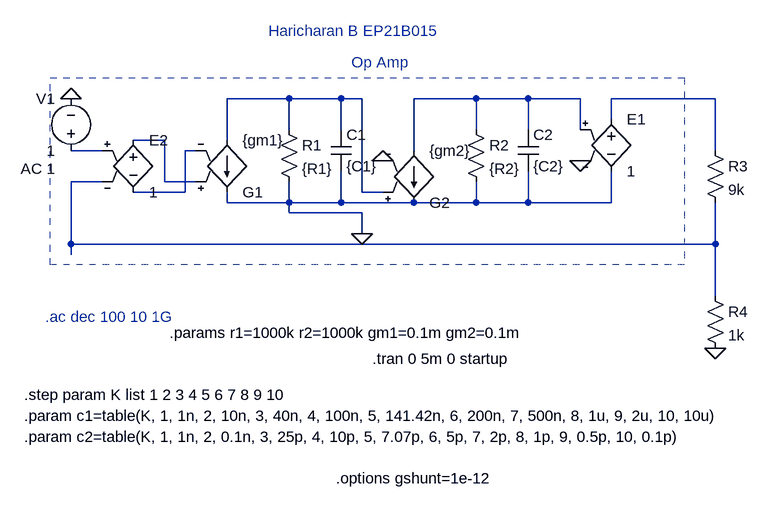
[diagram p0: schematic tut4 ii.asc]
tut4 ii.asc, the LTspice schematic file:
Version 4
SHEET 1 1236 680
WIRE 352 48 256 48
WIRE 432 48 352 48
WIRE 464 48 432 48
WIRE 640 48 544 48
WIRE 720 48 640 48
WIRE 800 48 720 48
WIRE 1008 48 848 48
WIRE 848 80 848 48
WIRE 352 96 352 48
WIRE 432 96 432 48
WIRE 640 96 640 48
WIRE 720 96 720 48
WIRE 800 96 800 48
WIRE 160 112 112 112
WIRE 256 112 256 48
WIRE 64 128 16 128
WIRE 208 128 192 128
WIRE 544 128 544 48
WIRE 1008 128 1008 48
WIRE 64 176 16 176
WIRE 160 176 160 112
WIRE 208 176 160 176
WIRE 192 192 192 128
WIRE 192 192 112 192
WIRE 464 192 464 48
WIRE 496 192 464 192
WIRE 256 208 256 192
WIRE 352 208 352 176
WIRE 352 208 256 208
WIRE 432 208 432 160
WIRE 432 208 352 208
WIRE 544 208 432 208
WIRE 640 208 640 176
WIRE 640 208 544 208
WIRE 720 208 720 160
WIRE 720 208 640 208
WIRE 848 208 848 160
WIRE 848 208 720 208
WIRE 352 224 352 208
WIRE 464 224 352 224
WIRE 464 256 464 224
WIRE 16 272 16 176
WIRE 1008 272 1008 208
WIRE 1008 272 16 272
WIRE 16 288 16 272
WIRE 1008 352 1008 272
FLAG 496 144 0
FLAG 16 48 0
FLAG 464 256 0
FLAG 800 144 0
FLAG 1008 432 0
SYMBOL g 256 208 M180
SYMATTR InstName G1
SYMATTR Value {gm1}
SYMBOL res 336 80 R0
SYMATTR InstName R1
SYMATTR Value {R1}
SYMBOL cap 416 96 R0
SYMATTR InstName C1
SYMATTR Value {C1}
SYMBOL g 544 224 M180
SYMATTR InstName G2
SYMATTR Value {gm2}
SYMBOL res 624 80 R0
SYMATTR InstName R2
SYMATTR Value {R2}
SYMBOL cap 704 96 R0
SYMATTR InstName C2
SYMATTR Value {C2}
SYMBOL e 848 64 R0
SYMATTR InstName E1
SYMATTR Value 1
SYMBOL voltage 16 144 R180
WINDOW 0 24 96 Left 2
WINDOW 3 24 16 Left 2
WINDOW 123 24 -12 Left 2
WINDOW 39 0 0 Left 0
SYMATTR InstName V1
SYMATTR Value 1
SYMATTR Value2 AC 1
SYMBOL e 112 96 R0
SYMATTR InstName E2
SYMATTR Value 1
SYMBOL res 992 112 R0
SYMATTR InstName R3
SYMATTR Value 9k
SYMBOL res 992 336 R0
SYMATTR InstName R4
SYMATTR Value 1k
TEXT 448 -8 Left 2 ;Op Amp
TEXT 168 408 Left 2 !.params r1=1000k r2=1000k gm1=0.1m gm2=0.1m
TEXT 480 448 Left 2 !.tran 0 5m 0 startup
TEXT 320 -56 Left 2 ;Haricharan B EP21B015
TEXT -24 384 Left 2 ;.ac dec 100 10 1G
TEXT -56 504 Left 2 !.step param K list 1 2 3 4 5 6 7 8 9 10
TEXT -56 536 Left 2 !.param c1=table(K, 1, 1n, 2, 10n, 3, 40n, 4, 100n, 5, 141.42n, 6, 200n, 7, 500n, 8, 1u, 9, 2u, 10, 10u)
TEXT -56 568 Left 2 !.param c2=table(K, 1, 1n, 2, 0.1n, 3, 25p, 4, 10p, 5, 7.07p, 6, 5p, 7, 2p, 8, 1p, 9, 0.5p, 10, 0.1p)
TEXT 424 632 Left 2 !.options gshunt=1e-12
RECTANGLE Normal 960 304 -16 16 1

The netlist it stands for:
* tut4 ii.asc
G1 N001 0 N004 N006 {gm1}
R1 N001 0 {R1}
C1 N001 0 {C1}
G2 N002 0 N001 0 {gm2}
R2 N002 0 {R2}
C2 N002 0 {C2}
E1 N003 0 N002 0 1
V1 N005 0 1 AC 1
E2 N004 N006 N005 N007 1
R3 N003 N007 9k
R4 N007 0 1k
* Op Amp
.params r1=1000k r2=1000k gm1=0.1m gm2=0.1m
.tran 0 5m 0 startup
* Haricharan B EP21B015
* .ac dec 100 10 1G
.step param K list 1 2 3 4 5 6 7 8 9 10
.param c1=table(K, 1, 1n, 2, 10n, 3, 40n, 4, 100n, 5, 141.42n, 6, 200n, 7, 500n, 8, 1u, 9, 2u, 10, 10u)
.param c2=table(K, 1, 1n, 2, 0.1n, 3, 25p, 4, 10p, 5, 7.07p, 6, 5p, 7, 2p, 8, 1p, 9, 0.5p, 10, 0.1p)
.options gshunt=1e-12
.backanno
.end